# EAGLE board octanis_eps_v1 (EAGLE 7.2.0)
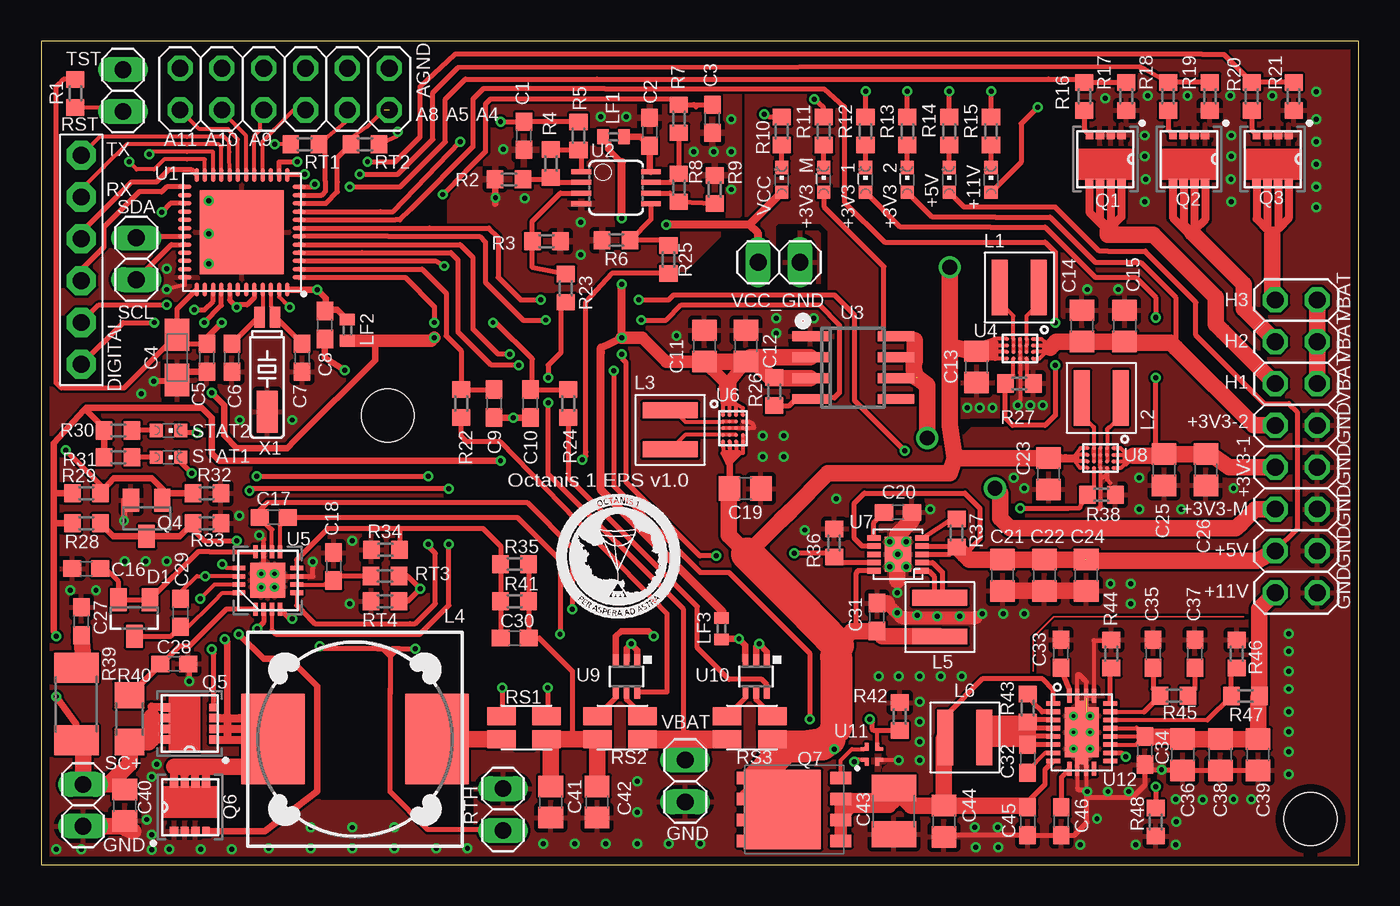
[diagram p2: board, top side]
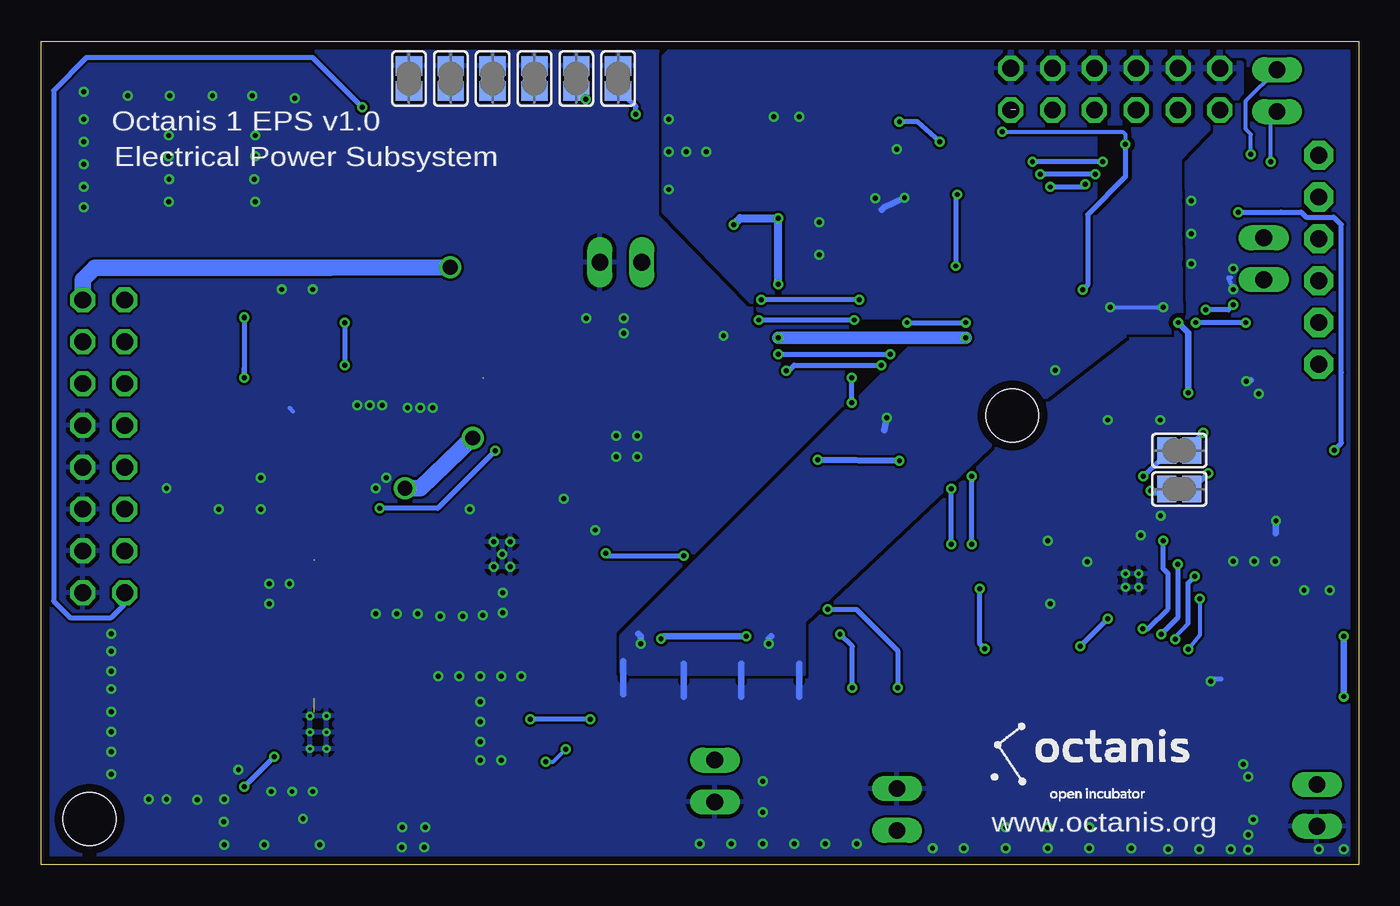
[diagram p3: board, bottom side, seen from below]

Size 80 x 50 mm. Coordinates in mm from the lower left corner, seen from the top.
Outline: 0,0 80,0 80,50 0,50 0,0
Copper layers (1*16): Top 0.035mm / dielectric 1.6mm / Bottom 0.035mm
Design rules "Elecrow_2-layer_PCB_eagle_rule": minimum track width 6mil, minimum drill 12mil, track to track 6mil, track to pad 6mil, pad to pad 6mil, via to via 8mil, smd to smd 0mil, copper to edge 20mil, drill to drill 10mil, minimum pad ring 6mil, minimum via ring 6mil, stop-mask expansion 0mil, vias tented up to drill 100mil, thermal gap 10mil
Net classes: 0 default: clearance 0.152 mm; 1 power: width 0.203 mm, drill 0.305 mm, clearance 0.152 mm; 3 fine: width 0.406 mm, drill 0.61 mm, clearance 0.152 mm
Holes 3.2 mm at 21.04,27.27 77.07,2.78
tRestrict: area 10.7,29.6 to 11,30.3; area 47.5,32.3 to 62.8,47.2; area 55.8,26.4 to 58.4,26.8; 13 lines

## Footprints (pad centres in the part's own frame; a part is rotated, then mirrored left to right if it is on the bottom)
CHIPLED_0603 = smd 0.8 x 0.8: A 0,-0.75; C 0,0.75
C0603 = smd 1.1 x 1: 1 -0.85,0; 2 0.85,0
A/3216-18R = smd 1.95 x 1.5: + 1.375,0; - -1.375,0
C0805 = smd 1.3 x 1.5: 1 -0.95,0; 2 0.95,0
C1210 = smd 1.6 x 2.7: 1 -1.4,0; 2 1.4,0
SOT23 = smd 1 x 1.4: 1 -0.95,-1.1; 2 0.95,-1.1; 3 0,1.1
1X06-BIG = drill 1.016 pad 1.778 octagon: 1 -6.35,0; 2 -3.81,0; 3 -1.27,0; 4 1.27,0; 5 3.81,0; 6 6.35,0
SJ = smd 1.168 x 1.6: 1 -0.762,0; 2 0.762,0
1X02 = drill 1.016 long: 1 -1.27,0; 2 1.27,0
2X06 = drill 1.016 octagon: 1 -6.35,-1.27; 2 -6.35,1.27; 3 -3.81,-1.27; 4 -3.81,1.27; 5 -1.27,-1.27; 6 -1.27,1.27; 7 1.27,-1.27; 8 1.27,1.27; 9 3.81,-1.27; 10 3.81,1.27; 11 6.35,-1.27; 12 6.35,1.27
2X08 = drill 1.016 octagon: 1 -8.89,-1.27; 2 -8.89,1.27; 3 -6.35,-1.27; 4 -6.35,1.27; 5 -3.81,-1.27; 6 -3.81,1.27; 7 -1.27,-1.27; 8 -1.27,1.27; 9 1.27,-1.27; 10 1.27,1.27; 11 3.81,-1.27; 12 3.81,1.27; 13 6.35,-1.27; 14 6.35,1.27; 15 8.89,-1.27; 16 8.89,1.27
XFL4020 = smd 0.965 x 3.353: P$1 -1.181,0; P$2 1.181,0
DR127 = smd 3.85 x 5.5: 1 -4.975,0; 2 4.975,0
0402 = smd 0.7 x 0.9: 1 -0.65,0; 2 0.65,0
DQG8 = smd 0.559 x 0.508: 1 -1.47,0.975; 2 -1.47,0.325; 3 -1.47,-0.325; 5 1.47,-0.975; 6 1.47,-0.325; 7 1.47,0.325; 8 1.47,0.975 | smd 0.559 x 0.457: 4 -1.47,-0.975
PG-TDSON-8 = smd 1.3 x 0.75: 1 -2.825,1.905; 2 -2.825,0.635; 3 -2.825,-0.635; 4 -2.825,-1.905; 5 2.825,-1.905; 6 2.825,-0.635; 7 2.825,0.635; 8 2.825,1.905 | smd 4.7 x 4.8: TH 0.725,0
R0603 = smd 1 x 1.1: 1 -0.85,0; 2 0.85,0
R2010 = smd 1.8 x 2.7: 1 -2.2,0; 2 2.2,0
R1206 = smd 1.6 x 1.803: 1 -1.422,0; 2 1.422,0
4PADS_RESISTOR = smd 1.727 x 1.1: I1 0,0; I2 2.751,0; V1 0,1.4; V2 2.751,1.4
S-PVQFN-N48 = smd 0.85 x 0.28: 1 -3.475,2.75; 2 -3.475,2.25; 3 -3.475,1.75; 4 -3.475,1.25; 5 -3.475,0.75; 6 -3.475,0.25; 7 -3.475,-0.25; 8 -3.475,-0.75; 9 -3.475,-1.25; 10 -3.475,-1.75; 11 -3.475,-2.25; 12 -3.475,-2.75; 25 3.475,-2.75; 26 3.475,-2.25; 27 3.475,-1.75; 28 3.475,-1.25; 29 3.475,-0.75; 30 3.475,-0.25; 31 3.475,0.25; 32 3.475,0.75; 33 3.475,1.25; 34 3.475,1.75; 35 3.475,2.25; 36 3.475,2.75 | smd 0.28 x 0.85: 13 -2.75,-3.475; 14 -2.25,-3.475; 15 -1.75,-3.475; 16 -1.25,-3.475; 17 -0.75,-3.475; 18 -0.25,-3.475; 19 0.25,-3.475; 20 0.75,-3.475; 21 1.25,-3.475; 22 1.75,-3.475; 23 2.25,-3.475; 24 2.75,-3.475; 37 2.75,3.475; 38 2.25,3.475; 39 1.75,3.475; 40 1.25,3.475; 41 0.75,3.475; 42 0.25,3.475; 43 -0.25,3.475; 44 -0.75,3.475; 45 -1.25,3.475; 46 -1.75,3.475; 47 -2.25,3.475; 48 -2.75,3.475 | smd 5.1 x 5.1: VSS_QFN 0,0
MSOP08 = smd 0.3 x 1.2: 1 -0.976,-2.113; 2 -0.326,-2.113; 3 0.324,-2.113; 4 0.974,-2.113; 5 0.974,2.112; 6 0.324,2.112; 7 -0.326,2.112; 8 -0.976,2.112
SO8 = smd 0.6 x 2.2: 1 -1.905,-2.6; 2 -0.635,-2.6; 3 0.635,-2.6; 4 1.905,-2.6; 5 1.905,2.6; 6 0.635,2.6; 7 -0.635,2.6; 8 -1.905,2.6
YFF0020AEBA = smd 0.229 x 0.229: 1 -0.6,0.8; 2 -0.2,0.8; 3 0.2,0.8; 4 0.6,0.8; 5 -0.6,0.4; 6 -0.2,0.4; 7 0.2,0.4; 8 0.6,0.4; 9 -0.6,0; 10 -0.2,0; 11 0.2,0; 12 0.6,0; 13 -0.6,-0.4; 14 -0.2,-0.4; 15 0.2,-0.4; 16 0.6,-0.4; 17 -0.6,-0.8; 18 -0.2,-0.8; 19 0.2,-0.8; 20 0.6,-0.8
RVA16_2P14X2P14 = smd 0.787 x 0.279: 1 -1.75,0.75; 2 -1.75,0.25; 3 -1.75,-0.25; 4 -1.75,-0.75; 9 1.75,-0.75; 10 1.75,-0.25; 11 1.75,0.25; 12 1.75,0.75 | smd 0.279 x 0.787: 5 -0.75,-1.75; 6 -0.25,-1.75; 7 0.25,-1.75; 8 0.75,-1.75; 13 0.75,1.75; 14 0.25,1.75; 15 -0.25,1.75; 16 -0.75,1.75 | smd 2.134 x 2.134: 17 0,0 | drill 0.254: V -0.406,-0.406; V_1 -0.406,0.406; V_2 0.406,-0.406; V_3 0.406,0.406
S-PVSON-N10 = smd 0.28 x 0.825: 1 -1,-1.462; 2 -0.5,-1.462; 3 0,-1.462; 4 0.5,-1.462; 5 1,-1.462; 6 1,1.462; 7 0.5,1.462; 8 0,1.462; 9 -0.5,1.462; 10 -1,1.462 | smd 2.15 x 1.6: EXPAD 0,0 | drill 0.3 pad 0.605: GND1 -0.762,0.508 | drill 0.3 pad 0.61: GND2 -0.762,-0.508; GND3 0,0; GND4 0.762,-0.508 | drill 0.305 pad 0.605: GND5 0.762,0.508
SC70-6 = smd 0.35 x 0.8: 1 -0.65,-0.95; 2 0,-0.95; 3 0.65,-0.95; 4 0.65,0.95; 5 0,0.95; 6 -0.65,0.95
QFN-4 = smd 0.23 x 0.49: P1 -0.325,0.45; P2 -0.325,-0.45; P3 0.325,-0.45; P4 0.325,0.45 | smd 0.49 x 0.23: P$1 -0.45,0.325; P$2 -0.45,-0.325; P$3 0.45,-0.325; P$4 0.45,0.325
R-PVQFN-N20 = smd 0.85 x 0.28: P$1 0,0; P$10 4.45,0; P$11 4.45,1.5; P$20 0,1.5 | smd 0.28 x 0.85: P$2 0.475,-0.975; P$3 0.975,-0.975; P$4 1.475,-0.975; P$5 1.975,-0.975; P$6 2.475,-0.975; P$7 2.975,-0.975; P$8 3.475,-0.975; P$9 3.975,-0.975; P$12 3.975,2.475; P$13 3.475,2.475; P$14 2.975,2.475; P$15 2.475,2.475; P$16 1.975,2.475; P$17 1.475,2.475; P$18 0.975,2.475; P$19 0.475,2.475 | smd 3.05 x 2.05: PGND1 2.225,0.75 | smd 1.15 x 0.23: PGND2 0.15,1.025; PGND3 0.15,0.475; PGND4 4.3,0.475; PGND5 4.3,1.025 | smd 3.85 x 0.78: PGND6 2.225,0.75 | drill 0.2 pad 0.4: PGND7 2.225,0.25; PGND8 1.225,0.25; PGND9 1.225,1.25; PGND10 2.225,1.25; PGND11 3.225,0.25; PGND12 3.225,1.25
MS3V-T1R = smd 0.635 x 1.27: P1 -0.47,-4.43; P2 0.47,-4.43 | smd 1.27 x 2.54: P3 0,1.3

## Placement (x,y rotation side)
+3V3_1  3V3-1  [CHIPLED_0603]  50.05,41.58 0 top
+3V3_2  3V3-2  [CHIPLED_0603]  52.59,41.58 0 top
+3V3_M  3V3-M  [CHIPLED_0603]  47.51,41.58 0 top
+5V  5V  [CHIPLED_0603]  55.13,41.58 0 top
+11V  12V  [CHIPLED_0603]  57.67,41.58 0 top
C1  1.5uF  [C0603]  29.3,44.26 90 top
C2  100nF  [C0603]  36.93,44.49 270 top
C3  1.5uF  [C0603]  40.75,45.29 90 top
C4  10uF  [A/3216-18R]  8.25,30.8 90 top
C5  100nF  [C0603]  10.06,30.78 270 top
C6  12pF  [C0603]  11.58,30.78 90 top
C7  12pF  [C0603]  15.85,30.78 90 top
C8  100nF  [C0603]  17.22,32.77 270 top
C9  1.5uF  [C0603]  27.5,28 90 top
C10  1.5uF  [C0603]  29.7,28 90 top
C11  22uF  [C0805]  40.27,31.5 90 top
C12  22uF  [C0805]  42.79,31.5 90 top
C13  10uF  [C0805]  56.79,30.23 270 top
C14  22uF  [C0805]  63.19,32.72 90 top
C15  22uF  [C0805]  65.78,32.72 90 top
C16  1uF  [C0603]  2.74,17.98 180 top
C17  100nF  [C0603]  14.11,21.09 180 top
C18  1uF  [C0603]  17.76,18.1 90 top
C19  10uF  [C0805]  42.75,22.84 0 top
C20  10nF  [C0603]  52.02,21.39 0 top
C21  22uF  [C0805]  58.37,17.58 270 top
C22  22uF  [C0805]  60.91,17.58 270 top
C23  10uF  [C0805]  61.16,23.73 270 top
C24  22uF  [C0805]  63.45,17.58 270 top
C25  22uF  [C0805]  68.17,23.98 270 top
C26  22uF  [C0805]  70.71,23.98 270 top
C27  2.2uF  [C0603]  2.44,14.78 90 top
C28  1uF  [C0603]  8.08,12.19 0 top
C29  100nF  [C0603]  8.45,15.29 270 top
C30  22pF  [C0603]  28.75,13.75 180 top
C31  22uF  [C0603]  50.75,15.04 90 top
C32  100nF  [C0603]  59.89,6.43 270 top
C33  2.2uF  [C0603]  61.91,12.8 90 top
C34  1uF  [C0603]  67.01,6.93 90 top
C35  150pF  [C0603]  67.51,12.8 90 top
C36  22uF  [C0805]  69.3,6.68 90 top
C37  4.7nF  [C0603]  70.05,12.8 90 top
C38  22uF  [C0805]  71.59,6.68 90 top
C39  22uF  [C0805]  73.88,6.68 90 top
C40  10uF  [C0805]  5.08,3.61 90 top
C41  10uF  [C0805]  30.94,3.81 270 top
C42  10uF  [C0805]  33.75,3.81 270 top
C43  47uF Tantal  [C1210]  51.77,3.25 270 top
C44  10uF  [C0805]  54.81,2.64 270 top
C45  100nF  [C0603]  59.89,2.64 270 top
C46  47nF  [C0603]  61.93,2.64 270 top
D1  BAT54C  [SOT23]  5.66,14.98 180 top
DIGITAL  [1X06-BIG]  2.44,36.73 90 top
J100  [SJ]  10.9,22.81 0 bottom
J101  [SJ]  10.9,25.15 0 bottom
J102  [SJ]  57.67,47.73 270 bottom
J103  [SJ]  55.13,47.73 270 bottom
J104  [SJ]  52.59,47.73 270 bottom
J105  [SJ]  50.05,47.73 270 bottom
J106  [SJ]  47.51,47.73 270 bottom
J107  [SJ]  44.97,47.73 270 bottom
JP1  [1X02]  4.96,47 90 top
JP2  [2X06]  14.78,47.09 0 top
JP3  [1X02]  5.77,36.79 270 top
JP4  [2X08]  76.2,25.4 90 top
JP5  [1X02]  2.54,3.61 90 top
JP6  [1X02]  39.1,5.08 90 top
L1  1uH  [XFL4020]  59.39,35.04 0 top
L2  1uH  [XFL4020]  64.36,28.34 0 top
L3  1uH  [XFL4020]  38.19,26.4 90 top
L4  DR127_6u8  [DR127]  19.05,7.62 0 top
L5  1uH  [XFL4020]  54.56,15.04 90 top
L6  1.5uH  [XFL4020]  56.08,7.72 0 top
LF1  100mH  [0402]  34.75,44.2 180 top
LF2  100mH  [0402]  18.59,32.46 270 top
LF3  100mH  [0402]  41.3,14.33 90 top
Q1  CSD16327Q3_DQG_8  [DQG8]  64.61,42.84 270 top
Q2  CSD16327Q3_DQG_8  [DQG8]  69.69,42.84 270 top
Q3  CSD16327Q3_DQG_8  [DQG8]  74.77,42.84 270 top
Q4  BSS123  [SOT23]  6.4,21.03 180 top
Q5  CSD16327Q3_DQG_8  [DQG8]  9.01,8.57 180 top
Q6  CSD16327Q3_DQG_8  [DQG8]  9.04,3.49 90 top
Q7  BSC0901NS  [PG-TDSON-8]  45.72,3.35 180 top
R1  10k  [R0603]  2.08,46.83 90 top
R2  200k (0.1%)  [R0603]  28.41,41.61 180 top
R3  100k (0.1%)  [R0603]  30.67,37.85 180 top
R4  100k (0.1%)  [R0603]  30.95,42.57 270 top
R5  1k  [R0603]  32.62,44.26 270 top
R6  100k (0.1%)  [R0603]  34.91,37.92 0 top
R7  1k  [R0603]  38.72,45.29 270 top
R8  100k (0.1%)  [R0603]  38.72,41.1 270 top
R9  330k (0.1%)  [R0603]  40.89,41 90 top
R10  1k  [R0603]  44.97,44.53 270 top
R11  1k  [R0603]  47.51,44.53 270 top
R12  1k  [R0603]  50.05,44.53 270 top
R13  1k  [R0603]  52.59,44.53 270 top
R14  1.5k  [R0603]  55.13,44.53 270 top
R15  4.7k  [R0603]  57.67,44.53 270 top
R16  1k  [R0603]  63.34,46.65 90 top
R17  1M  [R0603]  65.88,46.65 270 top
R18  1k  [R0603]  68.42,46.65 90 top
R19  1M  [R0603]  70.96,46.65 270 top
R20  1k  [R0603]  73.5,46.65 90 top
R21  1M  [R0603]  76.04,46.65 270 top
R22  1k  [R0603]  25.5,28 270 top
R23  200k (0.1%)  [R0603]  31.85,35 270 top
R24  1k  [R0603]  32,28 270 top
R25  330k (0.1%)  [R0603]  38.08,36.75 270 top
R26  1M  [R0603]  44.51,28.72 90 top
R27  1M  [R0603]  59.39,29.22 0 top
R28  dnp  [R0603]  2.74,22.56 180 top
R29  Rmpph  [R0603]  2.74,20.73 180 top
R30  4k7  [R0603]  4.67,26.37 180 top
R31  4k7  [R0603]  4.67,24.74 180 top
R32  1M  [R0603]  10.06,22.56 180 top
R33  Rmppl  [R0603]  10.06,20.73 180 top
R34  100k (1%)  [R0603]  20.9,19.12 0 top
R35  100k (1%)  [R0603]  28.75,18.25 0 top
R36  1M  [R0603]  48.14,19.54 270 top
R37  1M  [R0603]  55.58,20.14 270 top
R38  1M  [R0603]  64.36,22.46 0 top
R39  2  [R2010]  2.13,9.75 270 top
R40  10  [R1206]  5.37,8.86 90 top
R41  2.2M (1%)  [R0603]  28.75,16 0 top
R42  1M  [R0603]  52.12,8.99 270 top
R43  47k  [R0603]  59.89,9.51 270 top
R44  100k (1%)  [R0603]  64.97,12.8 270 top
R45  150-220k  [R0603]  68.78,10.26 180 top
R46  56k  [R0603]  72.59,12.8 270 top
R47  456k  [R0603]  73.11,10.24 0 top
R48  dnp  [R0603]  67.67,2.59 270 top
RS1  10m  [4PADS_RESISTOR]  27.94,7.62 0 top
RS2  10m  [4PADS_RESISTOR]  33.77,7.62 0 top
RS3  10m  [4PADS_RESISTOR]  41.64,7.62 0 top
RT1  2723  [R0603]  16,43.74 0 top
RT2  2723  [R0603]  19.66,43.74 180 top
RT3  2696  [R0603]  20.88,17.53 0 top
RT4  8187  [R0603]  20.88,16 180 top
RTH  103AT  [1X02]  28.04,3.35 270 top
STAT1  5V-ok  [CHIPLED_0603]  7.73,24.74 270 top
STAT2  5V-ok  [CHIPLED_0603]  7.73,26.37 270 top
U1  MSP430FR5969  [S-PVQFN-N48]  12.19,38.4 180 top
U2  OPA2333DGK  [MSOP08]  34.91,41.1 270 top
U3  TPS2022D  [SO8]  49.3,30.18 270 top
U4  TPS630250YFFT  [YFF0020AEBA]  59.43,31.33 270 top
U5  BQ24650_RVA_16  [RVA16_2P14X2P14]  13.76,17.26 90 top
U6  TPS630250YFFT  [YFF0020AEBA]  42,26.5 0 top
U7  TPS61232  [S-PVSON-N10]  52.02,18.85 90 top
U8  TPS630250YFFT  [YFF0020AEBA]  64.31,24.69 270 top
U9  INA213  [SC70-6]  35.54,11.43 180 top
U10  INA213  [SC70-6]  43.41,11.43 180 top
U11  MIC5019  [QFN-4]  50.44,6.71 90 top
U12  TPS61088  [R-PVQFN-N20]  62.43,10.26 270 top
VCC  3V3-EPS  [CHIPLED_0603]  44.97,41.58 0 top
VCC_GND  [1X02]  44.81,36.58 0 top
X1  32.768kHz  [MS3V-T1R]  13.72,28.8 180 top

## Tracks (layer width: path | path; a pad name or v marks a point on that pad's centre or on a via)
+3V3  (via drill 0.3)
  Top 0.229: 42.6,27.5 U6.4 42.6,27.74 42.06,28.04 42.22,27.89 42.2,27.87 U6.3 | U6.2 41.8,28 41.76,28.04 | U6.1 41.4,27.99 41.45,28.04
  Top 0.25: 40.89,29.93 C11.1 | 42.39,30.15 C12.1
  Top 0.254: 41.7,29.11 41.39,29.43 | 41.5,28.96 41.45,29.26
  Top 0.3: U3.3 45.45,29.55 R26.2 | v35.25,32 35.1,32 | R1.2 1.35,47.69 1.07,47.4 0.91,47.24 0.91,29.26 1.22,28.96 1.37,28.96 5.04,28.96 C4.+ | C4.+ 8.26,33.74 U1.37 | C4.+ 8.72,31.71 8.79,31.64 C5.1
  Top 0.305: VCC.A 45.12,40.83
  Top 0.406: 41.7,28.4 42.06,28.04 41.76,28.04 41.45,28.04 41.45,29.26 | LF2.2 19.66,31.81 20.27,31.83 20.27,30.63 15.54,25.91 15.39,25.76 14.94,25.3 11.89,25.3 11.12,26.06 11.12,27.89 v10.36,28.65 | v10.97,32.92 10.06,32 C5.1 | 41.38,15.37 41.23,15.05 LF3.2 | 35.25,42.67 35.2,42.67 34.44,43.43 34.44,43.85 LF1.2
  Top 0.5: v35.25,39.25 35.25,42.67 | v35.25,35.25 v35.25,32 33.98,31.39 33.98,31.09 33.98,22.77 34.1,22.65 41.38,15.37 | VCC.A 43,38.86 | 43,38.86 v37.95,38.86 | VCC_GND.1 43.54,38.33 43,38.86
  Top 0.75: 41.39,29.43 C11.1 37.95,30.55 36.5,32 v35.25,32 | C12.1 41.5,28.96 | v23.86,32 23.68,31.81 19.66,31.81 LF2.2
  Top 1: C11.1 C12.1 43.05,30.82 | 43.05,30.82 U3.2 | 43.05,30.82 44.33,29.55 U3.3 | 41.7,29.11 41.7,28.4
  Bottom 0.406: v10.36,28.65 10.36,32.31 v10.97,32.92
  Bottom 0.5: v35.25,35.25 v35.25,39.25 37.56,39.25 v37.95,38.86
  Bottom 0.75: v23.86,32 v35.25,32
+3V3_1  (via drill 0.3)
  Top 0.229: 65.12,25.3 arc90 U8.1 65.12,25.3 | 65.12,25.3 65.53,25.3 | U8.2 65.84,24.89 | 65.84,24.89 65.84,24.99 | U8.3 65.84,24.49 | 65.84,24.49 65.84,24.69 65.84,24.89 | 65.84,24.89 65.84,24.99 | 65.84,24.99 65.53,25.3 | 65.53,25.3 65.12,25.3 | 65.84,24.49 65.84,24.38 65.53,24.08 65.12,24.08 U8.4
  Top 0.25: 67.6,25.5 C25.1 | 68.1,25 C25.1 | 67.74,24.5 68.09,24.84 C25.1
  Top 0.305: +3V3_1.A 52.17,38.71 57.61,38.71 60.96,38.71 64.01,35.66 66.45,35.66 67.67,34.44 v67.67,33.22 | 67.6,25.5 67.67,25.56 v67.67,29.57
  Top 0.406: 65.84,24.69 66.29,24.84 | 65.84,24.89 65.94,24.89 66.29,24.84 | 66.29,24.84 65.84,24.38 65.84,24.69 | 65.84,24.69 65.84,24.99 65.84,24.69
  Top 0.5: 68.09,24.84 C25.1
  Top 1: C25.1 C26.1 70.83,25.04 72.12,24.13 JP4.8 | 66.29,24.84 68.09,24.84
  Bottom 0.305: v67.67,33.22 67.67,30.18 | 67.67,30.18 v67.67,29.57 67.67,30.18
+3V3_2
  Top 0.229: U4.4 60.6,30.73 60.96,31.09 60.92,31.13 | 60.92,31.13 U4.3 | U4.2 60.92,31.53 | 60.92,31.53 60.92,31.13 | U4.1 60.58,31.93 60.73,31.93 60.92,31.74 60.92,31.53 | 61.13,31.53 61.27,31.39
  Top 0.305: +3V3_2.A 54.1,39.32 57.91,39.32 61.27,39.32 64.01,36.58 66.75,36.58 68.89,34.44 68.89,31.39
  Top 0.406: 61.64,31.77 61.57,31.7 | 60.92,31.53 61.13,31.53 | 61.13,31.53 61.4,31.53 | 61.29,31.7 61.13,31.53
  Top 1: JP4.10 73.61,26.67 68.89,31.39 68.58,31.7 65.85,31.7 C15.1 C14.1 61.64,31.77 | 61.57,31.7 61.27,31.39
+3V3_M  (via drill 0.9)  (1 unrouted)
  Top 0.3: U3.8 51.16,32.09
  Top 0.305: 51.16,32.09 51.16,36.31 47.55,39.93 47.55,40.79 +3V3_M.A
  Top 0.406: U3.6 51.92,29.57 53.19,29.57 | U3.7 53.03,30.63 | 53.03,30.63 53.03,30.79 | 53.03,30.79 53.03,30.63 | 53.03,30.63 53.03,30.79 | 53.03,30.79 53.03,30.63 | U3.8 53.03,31.85
  Top 1: JP4.6 73.71,21.59 72.85,20.73 | 72.85,20.73 72.54,20.42 | 72.54,20.42 72.85,20.73 | 72.54,20.42 60.35,20.42 58.83,20.42 58.22,21.03 58.22,22.55 v57.91,22.86 | v53.8,25.91 53.8,29.11 53.19,29.57 | 53.14,29.58 arc-42 53.03,30.63 | 53.03,30.63 53.03,30.79 | 53.03,30.79 53.03,30.63 | 53.03,30.63 53.03,30.79 | 53.03,30.79 53.03,31.85
  Bottom 1: v57.91,22.86 57,22.86 v53.8,25.91
+5V  (1 unrouted)
  Top 0.25: 63.4,18.51 63.43,18.51
  Top 0.3: U7.4 55.52,19.35 R37.2 55.14,18.85 U7.3 | JP4.4 76.25,20.37 76.25,27.5 75.75,28 74.25,28 70.75,31.5 | 64.75,37.25 67.06,37.25
  Top 0.305: U7.7 49.84,19.35 49.38,19.81 49.38,21.95 49.99,22.55 56.08,22.55 57,21.64 57,19.79 56.04,18.83 | +5V.A 56.03,39.93 58.22,39.93 61.57,39.93 64.25,37.25 64.75,37.25 | 70.75,31.5 70.1,32.15 70.1,34.14 67.06,37.19 67.06,37.25
  Top 1: JP4.4 73.83,18.44 63.47,18.44 63.4,18.51 | 63.47,18.51 C24.1 C22.1 C21.1 56.34,18.53 56.04,18.83 R37.2
+12V  (via drill 0.3)
  Top 0.25: U12.P$16 66.51,8.29 | U12.P$14 66.52,7.29 | U12.P$15 C34.2
  Top 0.3: 66.51,8.29 C34.2 | 66.52,7.29 C34.2 | C34.2 | 59.5,45 v60.5,46
  Top 0.305: 59.5,45 59.5,42.66 +11V.A
  Top 1: C34.2 69.15,7.78 C36.2 C38.2 C39.2 73.88,10.16 R47.2 73.96,10.36 73.96,15.54 JP4.2
  Bottom 0.3: v60.5,46 63.5,49 77.25,49 79.25,47 79.25,16 78.25,15 75.75,15 75,15.75 75,16.44 JP4.2
A_EXT0  (1 unrouted)
  Top 0.25: 20.83,45.82 19.81,44.81 18.81,44.11 RT2.2
  Top 0.3: U1.10 16.23,40.16 17.3,40.16 17.98,40.84 17.98,41.45 17.98,42.91 RT2.2
A_EXT1
  Top 0.25: 18.59,45.17 17.25,44.07 RT1.2
  Top 0.254: 18.59,45.17 JP2.9
  Top 0.3: 17.25,44.07 17.25,41.48 17.25,40.88 17.07,40.69 17.03,40.66 U1.11
A_EXT2
  Top 0.254: U1.16 13.44,43.92 14.15,44.63 15.34,45.82 JP2.7
A_EXT3
  Top 0.254: U1.17 12.94,44.26 13.31,44.63 13.31,45.62 JP2.5
A_EXT4
  Top 0.254: U1.18 12.44,44.25 11.84,44.86 10.97,45.72 JP2.3
A_EXT5
  Top 0.254: U1.19 11.94,44.04 11.33,44.65 9.6,44.65 JP2.1
AGND  (via drill 0.3)
  Top 0.25: U1.47 14.44,34.48 14.78,34.14 v15.09,33.83
  Top 0.3: U1.41 11.44,34.28 v11.89,33.83 12.04,33.98 12.5,33.98 12.94,34.43 U1.44
  Top 0.406: C8.2 17.22,30.79 v18.44,30.02 | U9.2 35.54,13.14 v35.81,13.41 36.19,13.04 U9.1 | U10.2 43.41,13.23 v43.59,13.41 44.06,12.94 U10.1 | C10.1 28.83,27.15 v28.65,27.13 28.78,27.15 C9.1 | R2.2 27.56,40.13 v27.58,40.49
  Bottom 0.25: v15.09,33.83 12.65,33.83 v11.89,33.83
  Bottom 0.3: v11.89,33.83 12.19,33.83
  Bottom 0.406: v35.81,13.41 35.81,13.72 35.66,13.87 | v43.59,13.41 43.59,13.87 43.74,14.02 | v28.65,27.13 28.8,26.36 | v27.58,40.49 28.8,39.93 28.96,39.78 | 33.98,12.19 33.98,11.12 | 37.49,12.19 37.49,11.12 | 41,12.19 41,11.12 | 44.65,12.34 44.65,11.28
  other vias: 29.36,40.46 28.04,43.43 33.99,45.42 41.91,45.26 41.91,43.28 41.91,41 35.51,45.42 32.77,39.01 32.77,37.03 39.62,43.28 40.84,43.28
  pour Bottom (isolate 0.254): 10.85,32.38 16.48,32.38 16.61,40.84 21.49,45.72 21.49,49.68 8.23,49.68 7.16,48.62 7.16,46.79 10.95,42.85 10.92,42.57
  pour Bottom: 16.76,34.14 24.54,34.14 44.81,13.87 44.81,11.58 33.68,11.58 33.68,14.78 20.45,27.25 14.17,32.11
  pour Bottom: 16.15,33.22 35.97,33.22 42.21,39.62 42.21,49.07 41.61,49.68 16,49.68 16,34.59 16.61,33.99
  pour Top: 24.84,47.85 24.84,39.01 28.96,34.9 37.8,34.9 42.37,39.47 42.37,49.07 42.06,49.38 26.21,49.38 24.84,48.01
AVCC  (via drill 0.3)
  Top 0.25: RT1.1 v14.17,43.74 | U1.48 15.12,34.9 | RT2.1 21.64,44.26 v21.64,44.5
  Top 0.406: LF2.1 18.55,33.11 17.98,33.68 17.29,33.68 | 17.29,33.68 C8.1 | 17.29,33.68 17.29,34.38 v16.76,34.9 15.12,34.9
  Bottom 0.25: v21.64,44.5 20.42,44.5 14.33,44.5 14.17,44.35 v14.17,43.74
  Bottom 0.3: v14.17,43.74 14.17,41.76 16.46,39.47 16.46,35.2 v16.76,34.9
AVCC1  (via drill 0.3)
  Top 0.406: U9.3 34.89,13.4 34.89,13.86 35.2,14.17 36.88,14.17 v37.19,13.87 | LF3.1 41.34,13.72 v42.37,13.72 42.76,13.32 U10.3
  Bottom 0.406: v37.19,13.87 42.22,13.87 v42.37,13.72
AVCC2
  Top 0.406: LF1.1 36.38,44.2 C2.2 36.93,42.16 U2.8
BAT+  (via drill 0.3)
  Top 0.3: RS2.I2 38.87,7.62 39,7.75 39,15.5 30.85,23.65 30.79,23.71 v30.79,28.04 | R23.2 31.55,33.85 31.55,31.09 30.79,30.33 v30.79,29.57
  Top 1: JP6.2 39.1,7.47 39.25,7.62
  Top 1.1: RS2.I2 39.25,7.62 RS3.I1
  Bottom 0.3: v30.79,28.04 v30.79,29.57
BAT_11V
  Top 0.3: C45.1 59.89,3.81 60.96,4.88 60.96,5.79 U12.P$9 | U12.P$2 61.46,10.63 60.81,11.28 57.15,11.28 55.02,9.14 55.02,7.84 L6.P$1
  Top 0.75: Q7.3 51.1,3.99 C43.1 51.77,3.76 51.51,3.5 49.23,3.5 48.92,3.2 | Q7.1 Q7.2 | Q7.2 Q7.3 | Q7.2 Q7.3
  Top 1: C44.1 52.83,3.59 C43.1 | C44.1 54.81,7.63 L6.P$1 | C44.1 59.79,3.59 C45.1
BAT_OUT  (via drill 0.3, 0.9)
  Top 0.229: U6.16 U6.20 42.6,24.99 42.37,24.99 | U6.17 41.4,25.35 41.4,24.99 41.45,24.99 | 41.8,25.34 U6.18 41.8,24.43 | 42.2,25.44 U6.19 42.2,24.84 42.22,24.84 | U8.18 62.79,24.89 | 62.79,24.89 62.79,24.69 | U8.17 63.09,25.29 63.09,25.3 62.79,24.89 | U8.19 62.79,24.49 | 62.79,24.49 62.79,24.69 | U8.20 63.1,24.09 63.09,24.08 62.79,24.49 | 62.79,24.89 62.79,24.69 | 57.75,31.53 57.91,31.53 | 57.91,31.53 U4.18 | U4.17 57.91,31.93 57.3,31.7 57.91,31.53 | U4.19 57.91,31.13 57.61,31.13 57,31.04
  Top 0.25: 60.62,25 C23.1 60.98,24.5 | 41.89,23.04 C19.1 41.39,23.14 | U4.20 57.51,30.73 57.28,30.96 | U11.P$1 U11.P1 49.51,6.38 v49.38,6.25 | v48.16,7.01 48.16,7.2 47.79,7.57
  Top 0.3: U7.10 49.56,17.85 49.47,17.65
  Top 0.305: 49.47,17.65 49.47,14.19 49.38,14.19 | 48.26,12.61 48.26,13.31 48.35,13.31
  Top 0.406: C19.1 41.8,24.43 | 41.8,24.43 42.22,24.84 42.37,24.99 41.45,24.99 | 41.8,24.43 41.76,24.38 | 41.76,24.38 41.45,24.99 | 41.76,24.38 41.45,24.99 | 57.61,31.39 57.34,31.66 57.34,31.36 57.91,30.79 | 57.75,31.53 57.91,31.7 57.91,30.79 | 57.91,30.79 57.28,30.96 57,31.04 | 45.1,7.61 44.58,7.09
  Top 0.5: C23.1 61.88,24.68 62.18,24.69 62.79,24.69 | 56.88,31.36 57.15,31.24 57.34,31.36
  Top 1: C19.1 41.75,22.79 41.75,20 42.88,18.88 44.88,20.88 45.5,21.5 47.77,23.77 55.16,23.77 55.47,24.69 | 48.35,13.31 49.23,14.19 49.38,14.19 C31.1 51.08,13.86 L5.P$1 | 55.47,24.69 55.17,26.67 | 55.17,26.67 55.17,31.24 | 55.17,31.24 v55.17,36.27 55.17,31.24 | 55.47,24.69 60.55,24.69 C23.1 | JP4.11 JP4.13 | JP4.13 JP4.15 JP4.13 | 55.17,31.24 55.17,26.67 | RS3.I2 44.39,7.27 | 44.39,7.27 44.39,6.75 Q7.5 | 44.39,7.27 44.58,7.09 | 45.11,7.16 45.11,6.55 45.11,6.4 42.82,4.12 | C13.1 56.93,31.33 57.15,31.24 | 57,31.04 55.68,31.34 55.17,31.24
  Top 1.676: 48.26,8.32 47.85,7.61
  Top 1.93: 44.58,7.09 45.11,7.16 46.33,7.16 47.4,7.31 47.79,7.57 47.85,7.61 | 48.26,12.61 48.26,8.32
  Top 2: 48.35,13.31 46,15.75 42.88,18.88
  Bottom 0.25: v49.38,6.25 48.92,6.25 v48.16,7.01
  Bottom 1: JP4.15 77.47,35.53 76.75,36.25 62.46,36.25 v55.17,36.27
EN_3V3_1  (via drill 0.3)
  Top 0.229: U8.16 63.91,22.93 63.8,22.82 63.8,22.75 R38.1
  Top 0.3: U1.7 23.57,38.66 27.18,38.66 27.74,38.1 27.74,35.66 29.11,34.29 v30.33,34.29 | v36.27,34.29 38.1,34.29 38.41,34.59 48.16,34.59 49.38,33.38 49.38,28.19 v52.43,25.15 | v59.44,21.64 62.33,21.64 63.06,21.68 R38.1
  Bottom 0.3: v30.33,34.29 v36.27,34.29 | v52.43,25.15 55.93,21.64 v59.44,21.64
EN_3V3_2  (via drill 0.3)
  Top 0.229: R27.1 59.03,29.71 U4.16
  Top 0.3: 34.25,47.1 26.83,47.1 26.68,46.95 26.21,46.48 26.21,43.59 22.4,39.78 21.78,39.16 21.49,39.16 U1.8
  Top 0.305: 34.25,47.1 42.06,47.1 47.54,47.1 48.77,46.02 48.77,40.23 51.21,37.8 60.96,37.8 61.57,37.19 v61.57,32.92 | v61.57,30.33 61.57,28.35 61.57,27.28 60.96,26.67 58.98,26.67 58.52,27.13 58.52,28.35 58.52,29.2 R27.1
  Bottom 0.305: v61.57,32.92 v61.57,30.33
EN_3V3_M  (via drill 0.3)
  Top 0.3: 45.83,28.27 U3.4 46.77,28.35 48.16,28.35 48.46,28.65 48.46,32.77 47.24,33.98 38.86,33.98 37.95,33.07 v36.42,33.07 | U1.6 21.09,38.16 26.46,38.16 26.61,38.16 26.98,37.8 26.98,35.36 29.26,33.07 v30.63,33.07
  Top 0.305: R26.1 45.42,27.87 45.83,28.27
  Bottom 0.3: v30.63,33.07 v36.42,33.07
EN_5V  (via drill 0.3)
  Top 0.3: U7.9 48.63,18.35 R36.2 48.16,18.81 | v41,18.75 40,18.75 | v35.25,31 35.25,30.75 35.5,30.5 35.5,29 | U1.5 25.44,37.66 26.21,36.88 26.21,32.52 27.74,31 v28.44,31
  Top 0.305: R36.2 48.14,18.9 v45.72,18.9 | 35.5,29 35.5,23.25 40,18.75
  Bottom 0.3: 42.75,18.75 v41,18.75 | v35.25,31 v28.44,31
  Bottom 0.305: v45.72,18.9 45.72,18.75 v41,18.75
EN_12V  (via drill 0.3)
  Top 0.25: U11.P3 U11.P$3 50.77,8.12 50.75,8.14
  Top 0.3: v34.75,30 34.75,23 40.01,17.74 41.76,17.74 45.5,14 | v50.3,8.82 50.47,8.66 50.47,8.23 50.55,8.14 50.75,8.14 R42.2 | U1.4 19.48,37.16 24.87,37.16 25.3,36.73 25.3,32.36 27.33,30.33 v29.01,30.33
  Top 0.305: 45.5,14 46.65,12.85 v46.65,8.82
  Bottom 0.3: v46.65,8.82 v50.3,8.82 | v34.75,30 34.62,30 34.29,30.33 v29.01,30.33
EN_HEAT1  (via drill 0.3)
  Top 0.3: R16.2 R17.1 | 61.17,47.7 33.75,47.7 33.74,47.7 25.76,47.7 24.54,46.48 24.54,43.89 24.38,43.74 21.79,41.15 20.88,41.15 v18.75,41.15 | U1.12 16.61,41.16 v16.61,41.3
  Top 0.305: 61.17,47.7 62.84,47.7 R16.2
  Bottom 0.3: v18.75,41.15 16.76,41.15 v16.61,41.3
EN_HEAT2  (via drill 0.3)
  Top 0.3: R19.1 R18.2 | 66.71,48.45 25.29,48.39 23.77,46.87 23.77,44.04 21.64,41.91 21.03,41.91 v19.36,41.91 | U1.13 14.94,41.91 v16,41.91
  Top 0.305: 66.71,48.45 67.02,48.29 R18.2
  Bottom 0.3: v16,41.91 v19.36,41.91
EN_HEAT3  (via drill 0.3)
  Top 0.3: R21.1 R20.2 | 70.5,49.2 25.1,49.2 23.01,47.26 23.01,44.2 21.49,42.67 v19.81,42.67 | U1.14 14.44,42.67 v15.54,42.67
  Top 0.305: 70.5,49.2 71.81,49.2 R20.2
  Bottom 0.3: v15.54,42.67 v19.81,42.67
EN_SC  (via drill 0.3)
  Top 0.3: U1.27 7.85,40.16 v7.32,39.62 | v1.5,25.17 3.05,23.62 3.59,23.08 R28.1 | 4.51,23.47 4.42,23.47
  Top 0.406: R28.1 4.42,23.47 | 4.51,23.47 4.72,23.47 6.71,23.47 7.35,22.82 Q4.1 7.78,22.55 R32.2
  Bottom 0.3: v7.32,39.62 4.72,39.62 3.5,39.62 3.2,39.32 1.52,39.32 1.14,38.94 1.07,38.86 1.07,29.87 1.07,25.6 1.22,25.45 v1.5,25.17
GND  (via drill 0.3)  (1 unrouted)
  Top 0.229: U6.9 U6.10 U6.11 U6.12 42.98,26.5 | U6.8 42.9,26.9 arc-90 43.28,26.52 | U8.11 U8.12 64.31,23.5 64.31,23.47 | U8.11 U8.10 | U8.10 U8.9 | U8.11 U8.10 | U8.8 64.71,23.37 64.92,23.16 | U4.9 U4.10 U4.11 U4.12 59.43,29.87 59.44,29.87 | U4.8 59.83,29.62 R27.2
  Top 0.25: U5.11 13.51,19.74 | U12.PGND4 62.91,4.65 | U12.PGND5 63.46,4.6 | 63.61,10.26 U12.P$20 63.93,13.61 | U12.PGND3 62.91,11.48 | U12.PGND2 63.46,11.1 | U1.36 8.72,35.2 v7.62,34.92 | 11.22,38.35 U1.VSS_QFN | U4.12 59.43,28.2 arc90 v59.28,27.89 | U8.12 64.31,23.5 | 64.31,23.5 64.31,21.77 arc-90 64.14,21.59 | U8.8 64.71,23.89 arc-90 64.31,23.5 | v52.07,6.35 52.04,6.38 U11.P2 U11.P$2
  Top 0.254: 42.98,26.5 42.98,26.52 43.28,26.52
  Top 0.3: 13.51,19.74 v13.25,20 | 62.91,4.65 62.99,4.56 63.42,4.56 63.46,4.6 63.49,4.56 v63.5,4.45 63.49,4.06 | U12.PGND5 63.46,6.81 U12.PGND12 U12.PGND11 U12.PGND7 U12.PGND6 U12.PGND10 63.74,8.1 63.74,9.06 63.72,9.04 U12.PGND9 | U12.PGND8 U12.PGND9 | 63.46,9.26 U12.PGND9 | 63.93,13.61 R44.1 | 63.49,4.06 63.49,2.56 62.72,1.79 C46.2 C45.2 54.91,1.79 C44.2 | 63.49,4.06 66.24,4.06 67.01,4.83 C34.1 67.36,5.73 C36.1 C38.1 C39.1 | 16.5,18 16.5,17.5 16.49,17.51 U5.7 14.01,17.51 U5.17 | U5.V_3 13.5,17.81 13.5,19.5 | 62.91,11.48 62.99,11.56 63.46,11.1 | C28.2 8.99,12.13 v8.99,11.12 | U7.GND5 52.7,20.8 52.7,20.95
  Top 0.406: v6.83,29.36 8.26,29.41 C4.- 8.26,29.93 C5.2 | Q4.2 5.03,22.13 v5.03,20.88
  Top 0.5: U7.GND4 U7.GND5 52.12,19.05 U7.GND3 | U7.GND2 52.53,18.34 U7.GND3 | U7.GND1 51.51,18.34 U7.GND3
  Top 0.8: 51.34,15.89 52.22,15.01 56.75,15.01
  Top 1: JP5.1 4.76,2.34 C40.1 5.08,2.24 5.61,2.02 | C31.2 51.34,15.89 | C24.2 C22.2 C21.2 | 51.97,17.26 51.97,18.8 U7.GND3 51.97,18.9 51.97,20.01 52.87,20.91 C20.2
  Bottom 0.229: 64.72,27.53 64.92,27.74
  Bottom 0.25: v7.62,34.92 7.92,35.66 7.77,35.66
  Bottom 0.3: v8.99,11.12 8.84,11.28 8.38,11.28
  Bottom 0.406: v6.83,29.36 6.55,29.41 | v5.03,20.88 5.03,20.12 | 33.98,11.12 33.98,10.21 | 37.49,11.12 37.49,10.21 | 41,11.12 41,10.21 | 44.65,11.28 44.65,10.36
  other vias: 10.17,40.3 1.75,16.66 3.33,16.66 54.61,11.43 51.97,16.51 38.57,32.12 44.63,32.27 45.09,26.04 77.42,42.52 77.42,41.15 77.42,39.93 72.25,40.25 72.25,43.02 72.25,44.27 69.6,46.69 74.75,46.69 64.6,46.54 67,44.27 67,43.02 67,40.25 18.75,15.85 18.9,19.66 16.5,18.4 56.69,2.29 58.06,2.29 63.09,1.22 66.04,4.45 64.77,4.45 57.15,15.24 66.14,17.07 64.92,17.07 59.69,15.24 66.14,15.85 45.09,24.77 43.81,26.04 43.81,24.77 51.97,15.29 10.17,38.32 10.17,36.49 6.07,28.6 12.04,21.18 63.5,34.92 65.41,34.92 66.67,21.59 69.22,21.59 72.39,22.86 59.69,22.86 59.05,23.5 53.34,6.35 53.34,11.43 52.07,11.43 55.88,11.43 58.42,15.24 64.1,2.78 66.45,1.22 68.88,1.22 36.2,1.27 38.1,1.27 40.01,1.27 36.2,3.17 36.2,5.08 34.29,1.27 32.38,1.27 30.48,1.27 2.44,0.94 6.71,0.91 7.77,0.94 9.68,0.94 11.58,0.94 5.08,18.41 6.35,18.41 7.62,18.41 7.62,36.2 12.06,27 15.24,27 53.98,21.59 48.26,22.23 46.35,20.32 60.81,27.89 66.67,23.5 56.24,27.74 57.76,27.74 44.63,33.18 46.92,33.18 67.19,46.69 72.19,46.69 77.42,46.94 77.42,45.26 77.42,43.89 72.24,41.61 67.06,41.61 68.02,5.77 70.54,3.94 72.39,3.96 73.46,3.96 75.74,5.49 75.74,6.86 75.74,8.08 75.74,9.3 75.74,10.67 75.74,11.73 75.74,12.95 75.74,14.02 57,27.74 60.05,27.89 53.19,15.14 54.41,15.09 55.78,15.09 53.34,7.47 53.34,8.69 53.34,9.91 50.85,11.43 56.74,1.05 58.11,1.05 6.4,2.74 7.01,6.1 6.71,5.33 0.91,0.94 13.82,0.99 16.36,0.99 18.9,0.99 21.44,0.99 23.98,0.99 25.88,0.99 21.44,2.26 18.9,2.26 16.36,2.26 6.71,1.83 68.88,3.96 68.91,2.62
  pour Bottom (rank 2): 0,50 80,50 80,0 0,0
  pour Top (rank 2): -1.37,-2.59 0,50 80,51.22 80.3,-2.59
HEAT1
  Top 0.5: Q1.5 63.63,39.62 64.75,38.5 64.88,38.62 | Q1.8 65.58,39.34 64.88,38.62 | Q1.6 64.28,39.22 64.75,38.75 | 64.75,38.75 64.88,38.62 | Q1.7 64.94,38.94 64.75,38.75
  Top 1: 64.75,38.5 64.75,38.25 67.36,38.25 67.52,38.25 71.32,34.44 71.32,32.82 71.75,32.39 JP4.12
HEAT2
  Top 0.5: Q2.5 68.72,39.28 69.75,38.25 69.88,38.38 | Q2.8 70.67,39.16 70.02,38.52 | Q2.7 70.02,38.52 | 70.02,38.52 69.88,38.38 | Q2.6 69.36,38.88 69.88,38.38
  Top 1: JP4.14 74.93,31.82 73,33.75 73,35.25 69.88,38.38
HEAT3
  Top 0.5: Q3.5 73.8,39.2 74.44,38.55 | Q3.6 74.44,38.55 | 74.44,38.55 74.75,38.25 75.12,38.62 | Q3.8 75.75,39.24 75.12,38.62 | Q3.7 75.09,38.66 75.12,38.62
  Top 1: 74.75,38.25 74.75,34.47 JP4.16
I2C_SCL
  Top 0.3: JP3.2 7.91,37.66 U1.32
I2C_SDA
  Top 0.3: JP3.1 5.87,38.16 U1.31
I_IN
  Top 0.3: C9.2 R22.1 25.5,31.19 24.59,32.11 24.59,34.7 24.23,35.05 23.13,36.16 U1.2
I_OUT  (via drill 0.3)
  Top 0.3: R24.1 C10.2 29.82,28.97 29.82,30.71 27.61,32.92 v27.43,32.92 | U1.1 22.11,35.66 23.88,33.88 v23.88,32.92
  Bottom 0.3: v27.43,32.92 v23.88,32.92
IND
  Top 0.3: U7.1 53.88,17.85 54.22,17.51 54.22,16.56 L5.P$2 54.72,16.38 54.72,17.76 54.13,18.35 U7.2
LED5
  Top 0.3: +5V.C R14.2
N$1
  Top 0.229: 38.25,25.25 38.91,25.91 39.1,26.1 U6.13 U6.14 U6.15
  Top 0.25: 38.25,25.25 37.11,25.25 L3.P$1
N$2
  Top 0.3: U7.5 53.56,19.85 55.33,21.01 55.56,21.01 R37.1
N$3
  Top 0.229: 38.25,27.75 39.11,26.89 U6.5 U6.6 U6.7
  Top 0.25: 38.25,27.75 37.25,27.75 L3.P$2
N$4
  Top 1: L4.2 RS1.I1
N$5
  Top 0.3: U7.6 50.56,20.77 C20.1
N$6
  Top 0.229: 63.87,26.58 arc-90 63.91,26.54 U8.13 | U8.13 U8.14 | U8.14 U8.15 | U8.14 U8.13
  Top 0.25: 63.87,26.58 63.13,27.32 63.13,28.29 L2.P$1
N$7
  Top 0.229: 64.85,26.54 arc90 64.71,26.4 U8.5 | U8.5 U8.6 | U8.6 U8.7 | U8.6 U8.5
  Top 0.25: 64.85,26.54 65.63,27.32 65.63,28.25 L2.P$2
N$8
  Top 0.1: 73.02,15.06 61.47,15.06 60.22,13.81 60.22,11.76
N$9  (via drill 0.3)
  Top 0.3: U12.P$13 65.6,6.79 v65.84,6.55 | v67.67,4.72 67.67,3.87 R48.1
  Bottom 0.3: v65.84,6.55 v67.67,4.72
N$10
  Top 0.25: Q7.4 48.55,6.33 49.23,7.01 49.97,7.01 U11.P4 U11.P$4
N$11
  Top 0.229: L1.P$1 58.22,35.03 58.22,34.14 59.03,33.32 U4.13 U4.14 U4.15
N$12
  Top 0.229: L1.P$2 60.66,34.95 60.66,34.14 59.83,33.31 U4.5 U4.6 U4.7
N$13  (via drill 0.3)
  Top 0.25: U1.23 9.94,42.82 8.84,42.82 7.47,42.82 6.86,42.22 5.79,42.22 v5.33,42.67 | R1.1 4.71,45.98 JP1.1
  Bottom 0.25: v5.33,42.67 5.33,45.36 JP1.1
N$14  (via drill 0.3)
  Top 0.305: R14.1 J103.2
  Bottom 0.305: J103.2 55.2,46.97 55.47,47.24
  other vias: 55.13,46.97
N$15  (via drill 0.3)
  Top 0.25: U1.22 10.44,43.28 8.84,43.28 6.71,43.28 v6.55,43.13
  Bottom 0.25: v6.55,43.13 6.55,44.35 6.86,44.65 6.86,46.37 JP1.2
N$16
  Top 0.25: U1.46 13.94,33.94 X1.P1 14.26,33.62
  Top 0.3: C7.2 14.19,33.3 X1.P1
N$17
  Top 0.25: U1.45 13.44,33.69 X1.P2
  Top 0.3: C6.2 13.25,33.3 X1.P2
N$18
  Top 0.25: 2.44,35.81 DIGITAL.3
  Top 0.3: U1.25 7.63,41.16 7.32,40.84 5.94,40.84 3.81,38.71 3.81,37.49 2.44,36.12 DIGITAL.3
N$19
  Top 0.3: R4.1 30.96,43.41 R5.2 32.8,43.23 U2.1
N$20
  Top 0.3: R2.1 30.83,41.61 arc90 R4.2 31.24,41.43 U2.2
N$21
  Top 0.3: R23.1 29.82,36.26 R3.2 29.82,39.07 31.53,40.78 U2.3
N$22
  Top 0.3: U2.7 38.2,41.43 R8.1 R7.2
N$23
  Top 0.3: U2.6 38.19,40.78 R8.2 R9.1
N$24
  Top 0.3: U2.5 37.02,39.19 R6.2 37.92,37.92 R25.1
N$25
  Top 0.3: R24.2 32,23.5 39.84,15.66 39.84,13.16 41.75,11.25 43.75,11.25 44.08,10.92 44.08,10.5 U10.6
N$26
  Top 0.3: U9.6 36.21,10.5 38,10.5 38,15.25 27.89,25.66 25.84,25.66 25.5,26 R22.2
N$27
  Top 0.3: R20.1 73.5,44.61 Q3.4
N$28
  Top 0.3: DIGITAL.4 2.44,38.41 5.49,41.45 7.01,41.45 7.77,42.22 9.11,42.22 U1.24
N$29  (via drill 0.3)
  Top 0.3: DIGITAL.2 3.5,33.98 v7.62,33.98 | v9.3,33.68 9.91,33.68 10.44,34.22 U1.39
  Bottom 0.3: v7.62,33.98 7.92,33.68 v9.3,33.68
N$30  (via drill 0.3)
  Top 0.3: DIGITAL.1 4.98,32.92 v6.86,32.92 | v9.91,32.92 10.94,33.95 U1.40
  Bottom 0.3: v6.86,32.92 v9.91,32.92
N$31
  Top 0.3: R18.1 68.42,44.61 Q2.4
N$32
  Top 0.3: U10.4 42.76,10.14 RS3.V1
N$33
  Top 0.3: U10.5 43.41,10 RS3.V2
N$34
  Top 0.3: U9.4 34.89,10.14 RS2.V1
N$35
  Top 0.3: U9.5 35.54,10 RS2.V2
N$36
  Top 0.25: U1.21 10.94,43.59 10.79,43.74 8.84,43.74 5.18,43.74 3.81,42.37 | 3.81,42.37 2.44,41 | 2.44,41 DIGITAL.5 | 3.81,42.37 2.44,41
N$37
  Top 0.3: R16.1 63.34,44.61 Q1.4
N$38
  Top 0.25: U12.P$8 60.97,6.79 59.89,5.71
  Top 0.3: 59.89,5.71 C32.2
N$39
  Top 0.3: +3V3_M.C R11.2
N$40  (via drill 0.3)
  Top 0.305: R11.1 47.51,45.96 v46.94,46.48
  Bottom 0.305: v46.94,46.48 47.17,46.63 J106.2
N$41
  Top 0.25: U1.20 11.43,43.26 11.43,43.89 11.28,44.04 11.12,44.2 8.84,44.2 3.56,44.2 DIGITAL.6
N$42
  Top 1: C27.1 2.59,12.19 R39.1
N$43
  Top 0.3: VCC.C R10.2
N$45  (via drill 0.3)
  Top 0.305: R10.1 44.23,45.38 v43.89,45.57
  Bottom 0.305: v43.89,45.57 43.89,46.05 J107.2
N$46
  Top 0.3: +3V3_2.C R13.2
N$47  (via drill 0.3)
  Top 0.305: R13.1 J104.2
  Bottom 0.305: J104.2 52.15,46.97 52.12,46.63
  other vias: 52.59,46.97
N$48
  Top 0.3: +11V.C R15.2
N$49  (via drill 0.3)
  Top 0.305: R15.1 J102.2
  Bottom 0.305: J102.2 57.94,46.97 58.22,47.24
  other vias: 57.67,46.97
N$50
  Top 0.3: U12.P$4 57.49,8.79 57.49,8.81 57.26,8.81 57.26,8.56 L6.P$2 | U12.P$5 57.26,8.29 L6.P$2 | U12.P$6 57.26,7.79 L6.P$2 | U12.P$7 57.26,7.29 L6.P$2
  Top 1: L6.P$2 59.89,7.72 C32.1 R43.2 | 59.89,8.56 57.26,8.56
N$51
  Top 0.3: +3V3_1.C R12.2
N$52  (via drill 0.3)
  Top 0.305: R12.1 J105.2
  Bottom 0.305: J105.2 50.32,46.97 50.6,47.24
  other vias: 50.05,46.97
N$53
  Top 0.3: U12.P$3 60.77,9.29 60.24,9.81 60.24,10.01 R43.1
N$54
  Top 0.3: C37.1 70.05,10.68 R45.1
N$56
  Top 0.3: U12.P$10 61.93,5.31 C46.1
N$57
  Top 0.3: U12.P$19 64.91,11.89 R44.2
N$58
  Top 0.25: U12.P$18 66.96,9.29
  Top 0.3: 66.96,9.29 R45.2 67.51,10.68 C35.1
N$59
  Top 0.3: U12.P$1 62.43,10.68 C33.1
N$60
  Top 0.25: U12.P$17 70.81,8.79
  Top 0.3: 70.81,8.79 R47.1 72.26,11.62 R46.2
N$64  (via drill 0.3)
  Top 0.3: 6.21,20.12 Q4.3 | U5.2 13.51,14.73 v13.11,14.33 | R33.2 9.21,20.36 9.75,19.81 9.91,19.66 11.73,19.66 v11.89,19.66
  Top 0.406: 9.02,20.85 R33.2 8.41,19.93 Q4.3 | 6.21,20.12 Q4.3 | Q4.3 4.39,19.93 R29.1
  Bottom 0.3: v13.11,14.33 12.8,14.33 11.58,15.54 11.58,17.68 11.89,17.98 v11.89,19.66
N$66
  Top 0.3: STAT1.A R31.1
N$67  (via drill 0.3)
  Top 0.3: v9.45,26.21 8.64,26.21 STAT2.C
  Bottom 0.3: J101.2 10.14,25.52 v9.45,26.21
N$68  (via drill 0.3)
  Top 0.3: v9.14,23.77 8.48,24.43 STAT1.C
  Bottom 0.3: J100.2 10.11,22.81 9.45,23.47 v9.14,23.77
N$69
  Top 0.3: STAT2.A R30.1
N$70  (via drill 0.3)
  Top 0.25: U5.5 15.51,15.74
  Top 0.3: 15.51,15.74 16.25,15 16.62,14.63 22.4,14.63 22.71,14.63 23.93,15.85 23.93,18.9 23.5,19.32 v23.5,19.47 | v13.08,23.59 v23.5,23.59
  Bottom 0.3: v23.5,19.47 v23.5,23.59 | v13.08,23.59 12.01,24.65 J101.1
N$71  (via drill 0.3)
  Top 0.25: U5.3 14.01,14.24
  Top 0.3: 14.01,14.24 14.25,14 23,14 24.75,15.75 v24.75,19.47 | v24.75,22.84 13.1,22.84 12.78,22.84 v12.65,22.71
  Bottom 0.3: v24.75,19.47 v24.75,22.84 | v12.65,22.71 12.32,22.55 J100.1
N$72
  Top 0.25: U5.6 17.24,17.01
  Top 0.3: 17.24,17.01 C18.1 18.03,17.53 RT3.1
N$73
  Top 0.3: U5.1 11.24,15.51 9.75,14.02 8.99,13.26 8.38,13.26 7.32,12.19 C28.1
  Top 0.406: R40.2 7.23,12.15 C28.1
N$76  (via drill 0.3)
  Top 0.25: U5.14 v9.96,17.51 | C29.1 8.45,16.53 9.45,17.53 9.91,17.53 | 9.91,17.53 10.24,17.53 v9.96,17.51 | v9.96,17.51 9.92,17.51 9.91,17.53
  Top 0.3: Q5.3 10.87,8.9
  Top 0.406: 11.3,9.02 11.3,13.54 v11.15,13.7
  Top 0.5: Q5.1 11.15,7.6 11.28,7.6 | 11.28,7.6 14.05,7.6 L4.1 | 14.15,8.25 Q5.2 13.7,8.25 13.72,8.23 | 14.15,8.25 14.17,8.23 | 10.87,8.9 12.04,8.9 14.69,8.9 14.94,9.14 | 14.15,8.25 14.15,7.7 L4.1 | 13.56,8.99 13.47,8.9 Q5.3 11.09,8.9 11.3,8.84 | Q6.8 8.07,5.93 8.08,5.94 | 12.95,5.94 13.41,6.4 13.41,6.96 L4.1 | Q6.7 8.72,5.82 8.84,5.94 | Q6.6 9.37,5.86 9.45,5.94 | Q6.5 10.02,5.83 9.91,5.94 | 11.3,9.02 11.3,8.84 | 11.3,8.84 11.3,7.72 11.28,7.6
  Top 1: 12.95,5.94 9.91,5.94 | 9.91,5.94 9.45,5.94 | 9.45,5.94 8.84,5.94 | 8.84,5.94 8.08,5.94 8.6,5.94 8.72,5.82 | 8.84,5.94 9.29,5.94 9.37,5.86 | 9.45,5.94 9.91,5.94
  Bottom 0.25: v11.15,13.7 10.99,14 10.52,14.48 10.36,14.63 | 10.06,17.41 v9.96,17.51
  Bottom 0.3: 10.36,14.63 10.36,17.1 v9.96,17.51
N$77  (via drill 0.3)
  Top 0.25: U5.10 14.01,20.34
  Top 0.3: 14.01,20.34 C17.2 13.26,21.51 13.75,22 29.5,22 32.25,19.25 v32.25,15.5 | v28,10.75 28,9.08 RS1.V1
  Bottom 0.3: v32.25,15.5 30.5,15.5 28,13 v28,10.75
N$78  (via drill 0.3)
  Top 0.25: U5.9 14.51,20.64
  Top 0.3: 14.51,20.64 C17.1 28.91,21.09 31.5,18.5 v31.5,14 | v30.75,10.75 30.75,9.08 RS1.V2
  Bottom 0.3: v30.75,10.75 30.75,13.25 v31.5,14
N$80  (via drill 0.3)
  Top 0.25: U5.15 10.76,17.01 10.52,17.01 v9.65,16.14
  Top 0.3: Q5.4 10.48,12.81 v10.36,13.09
  Bottom 0.25: v9.65,16.14 9.65,13.95 v10.36,13.09
N$81  (via drill 0.3)
  Top 0.25: U5.13 11.24,18.01 v11,18.25
  Top 0.406: Q6.4 13.57,2.02 16.77,4.46 16.76,4.76 16.76,10.82 15.08,12.5 13.5,12.5 v12,14
  Bottom 0.3: v11,18.25 11,15 v12,14
N$82
  Top 0.25: U5.8 15.51,18.51
  Top 0.3: 15.51,18.51 16.25,19.25 17.42,20.42 21.79,20.42 | C30.2 R41.1 R35.1 27.9,19.34 26.82,20.42 21.79,20.42 | R34.2 21.6,19.1 21.79,19.29 21.79,20.42
N$84
  Top 0.3: U5.12 10.25,19 9.53,19 D1.1 D1.2 4.71,17.18 3.9,17.98 C16.1
N$85
  Top 0.25: U5.16 11,16.5 10.51,16.01 8.79,14.29 C29.2 8.11,14.44
  Top 0.3: U5.16 | D1.3 7.89,13.88 C29.2
SC+  (via drill 0.3)
  Top 0.3: 3.88,26.43 R30.2 | R25.2 34.65,35.9 33.07,34.17 | 33.07,34.17 33.04,34.14 | 33.07,34.17 33.07,25.06 33.07,24.8 v32.85,24.59
  Top 0.406: R39.2 2.13,8.53 v0.91,10.21 | v0.91,13.87 0.76,14.17 0.76,20.73 | 0.76,20.73 0.76,22.55 | 0.76,22.55 0.76,25.6 2.59,27.58 | R28.2 0.76,22.55 | R29.2 0.76,20.73 | 2.59,27.58 2.74,27.74 9.75,27.74 10.36,27.13 10.36,24.99 10.82,24.54 12.95,24.54 16.46,24.54 25.15,24.54 27.74,24.54 v27.89,24.54 | R30.2 R31.2 | 3.88,26.43 2.72,27.58 2.59,27.58
  Top 0.5: 6.99,8.99 6.71,8.99 6.71,9.6 6.76,9.55 Q5.5 | 6.76,8.9 Q5.6 6.76,8.9 | 6.76,8.9 6.71,8.84 6.76,8.9 | Q5.7 6.72,8.25 6.71,8.23 | Q5.8 6.88,7.6 6.71,7.77
  Top 1: 4.12,4.88 JP5.2 2.54,7.15 R39.2 | 4.12,4.88 4.76,4.88 C40.2 | 4.12,4.88 5.37,6.13 R40.1 6.53,7.44 6.71,7.62 6.71,7.77 6.71,8.23 6.71,8.84 6.71,8.99
  Bottom 0.406: v0.91,10.21 v0.91,13.87 | v27.89,24.54 32.97,24.59 v32.85,24.59
SC_OUT
  Top 0.3: R35.2 R41.2 C30.1 30.25,13.75 32.25,11.75 32.25,7.87 32.5,7.62
  Top 1: C41.1 30.94,7.37 RS1.I2 32.5,7.62 RS2.I1 33.75,7.6 C42.1
TS  (via drill 0.3)
  Top 0.3: RT3.2 22.25,17.53 v23.01,16.76 22.25,16 RT4.1 | RTH.2 27.99,2.13 23.47,2.13 21.18,4.42 21.18,10.36 | 21.18,10.36 21.18,10.67 | U5.4 15.09,14.94 v15.24,14.94 | 16.92,13.11 v16.92,13.26 16.92,13.11 | 20.42,13.11 21.79,13.11 | 20.42,13.11 20.73,13.11 21.18,12.65 21.64,13.11 21.79,13.11 | 21.79,13.11 21.34,13.11 arc90 21.18,12.95 21.18,10.36 | 21.79,13.11 v22.71,13.11 | 20.42,13.11 16.92,13.11
  Bottom 0.3: v22.71,13.11 23.01,13.41 v23.01,16.76 | v15.24,14.94 16.61,13.56 v16.92,13.26
V_BAT  (via drill 0.3)
  Top 0.3: U1.9 20.61,39.66 21.37,39.66 v25.45,43.89 | v27.89,45.11 C1.2 R5.1
  Bottom 0.3: v25.45,43.89 26.82,45.11 v27.89,45.11
V_SC  (via drill 0.3)
  Top 0.3: R7.1 C3.2 | R7.1 39.61,46.14 arc-90 39.75,46 | U1.3 23.93,36.66 | 23.93,36.66 v24.46,36.35 23.93,36.66 | R7.1 38.38,46.48 27.28,46.48 26.98,46.18 26.98,43.28 25.76,42.06 v24.38,40.69
  Bottom 0.3: v24.38,40.69 24.46,40.61 v24.46,36.35

## Text on the board
tNames: TST | AGND | RST | A8 | A5 | A4 | A11 | A10 | A9 | TX | RX | SDA | L1 | H3 | SCL | VBAT | H2 | H1 | VBAT | L3 | VBAT | +3V3-2 | L2 | GND | Octanis 1 EPS v1.0 | GND | +3V3-M | +3V3-1 | +5V | GND | GND | +11V | GND | L5 | L6 | RS1 | VBAT | SC+ | RS2 | RS3 | GND | GND
bNames: Octanis 1 EPS v1.0 | Electrical Power Subsystem | www.octanis.org